# Altium schematic sheet EdgeMax_MCU.SchDoc
size A3; SheetNumber: 1; SheetTotal: 3
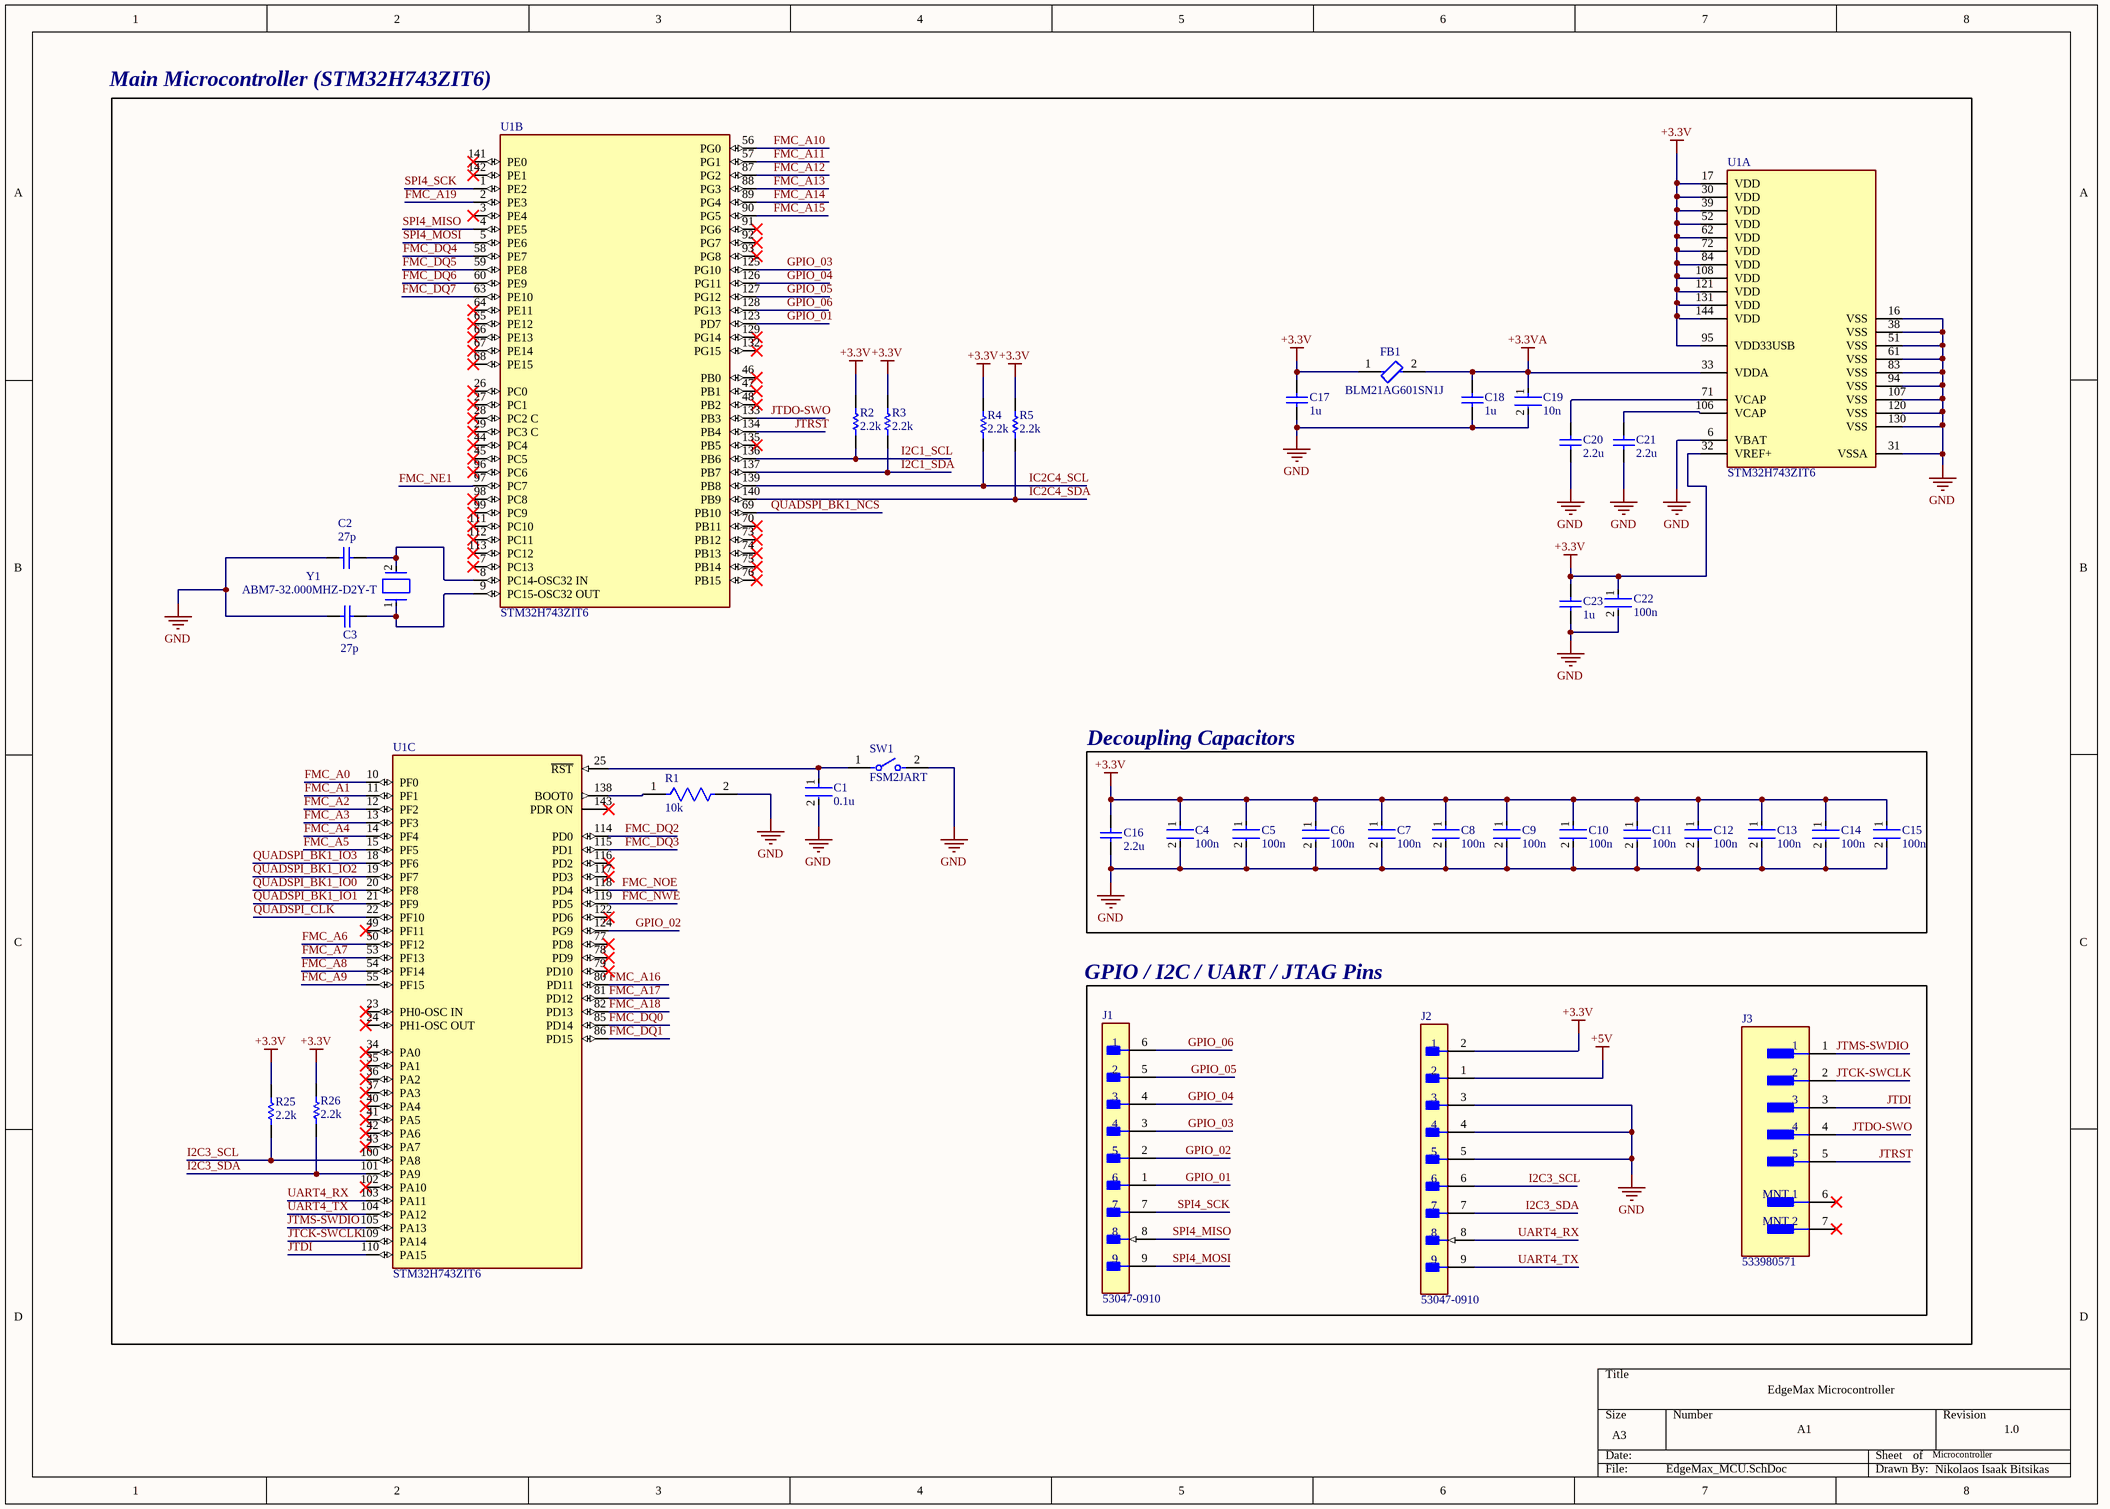
[diagram p0: EdgeMax_MCU.SchDoc]

## Parts
C1  0.1u  [FP-C1206C-EB-MFG]
C2  27p  [CAPC1005X55X25LL05T10]
C3  27p  [CAPC1005X55X25LL05T10]
C4  100n  [FP-CL10-IPC_A]
C5  100n  [FP-CL10-IPC_A]
C6  100n  [FP-CL10-IPC_A]
C7  100n  [FP-CL10-IPC_A]
C8  100n  [FP-CL10-IPC_A]
C9  100n  [FP-CL10-IPC_A]
C10  100n  [FP-CL10-IPC_A]
C11  100n  [FP-CL10-IPC_A]
C12  100n  [FP-CL10-IPC_A]
C13  100n  [FP-CL10-IPC_A]
C14  100n  [FP-CL10-IPC_A]
C15  100n  [FP-CL10-IPC_A]
C16  2.2u  [CAPC2013X135X50ML10T20]
C17  1u  [CAPC2013X145X50LL20T25]
C18  1u  [CAPC2013X145X50LL20T25]
C19  10n  [FP-CC0402-MFG]
C20  2.2u  [CAPC2013X135X50ML10T20]
C21  2.2u  [CAPC2013X135X50ML10T20]
C22  100n  [FP-CL10-IPC_A]
C23  1u  [CAPC2013X145X50LL20T25]
FB1  BLM21AG601SN1J  [FP-BLM21-0_2-t0_85-e0_5-IPC_A]
J1  53047-0910  [FP-53047-0910-MFG]
J2  53047-0910  [FP-53047-0910-MFG]
J3  533980571  [FP-533980571-MFG]
R1  10k  [FP-AC0603-MFG]
R2  2.2k  [RESC1005X40X25LL05T05]
R3  2.2k  [RESC1005X40X25LL05T05]
R4  2.2k  [RESC1005X40X25LL05T05]
R5  2.2k  [RESC1005X40X25LL05T05]
R25  2.2k  [RESC1005X40X25LL05T05]
R26  2.2k  [RESC1005X40X25LL05T05]
SW1  FSM2JART  [FP-FSM2JART-MFG]
U1  STM32H743ZIT6  [FP-LQFP144-1A-MFG]  (parts A,B,C of 3)
Y1  ABM7-32.000MHZ-D2Y-T  [FP-ABM7-MFG]

## Blocks framed on the sheet
Main Microcontroller (STM32H743ZIT6): C1-C3 C17-C23 FB1 R1-R5 R25 R26 SW1 U1 Y1
Decoupling Capacitors: C4-C16
GPIO / I2C / UART / JTAG Pins: J1-J3

## Nets
+3.3V: C4.1 C5.1 C6.1 C7.1 C8.1 C9.1 C10.1 C11.1 C12.1 C13.1 C14.1 C15.1 C16.2 C17.2 C22.1 C23.2 FB1.1 J2.2 R2.2 R3.2 R4.2 R5.2 R25.2 R26.2 U1.17(VDD) U1.30(VDD) U1.32(VREF+) U1.39(VDD) U1.52(VDD) U1.62(VDD) U1.72(VDD) U1.84(VDD) U1.95(VDD33USB) U1.108(VDD) U1.121(VDD) U1.131(VDD) U1.144(VDD)
+3.3VA: C18.2 C19.1 FB1.2 U1.33(VDDA)
+5V: J2.1
GND: C1.2 C2.2 C3.1 C4.2 C5.2 C6.2 C7.2 C8.2 C9.2 C10.2 C11.2 C12.2 C13.2 C14.2 C15.2 C16.1 C17.1 C18.1 C19.2 C20.1 C21.1 C22.2 C23.1 J2.3 J2.4 J2.5 R1.2 SW1.2 U1.6(VBAT) U1.16(VSS) U1.31(VSSA) U1.38(VSS) U1.51(VSS) U1.61(VSS) U1.83(VSS) U1.94(VSS) U1.107(VSS) U1.120(VSS) U1.130(VSS)
FMC_A0: U1.10(PF0)
FMC_A1: U1.11(PF1)
FMC_A2: U1.12(PF2)
FMC_A3: U1.13(PF3)
FMC_A4: U1.14(PF4)
FMC_A5: U1.15(PF5)
FMC_A6: U1.50(PF12)
FMC_A7: U1.53(PF13)
FMC_A8: U1.54(PF14)
FMC_A9: U1.55(PF15)
FMC_A10: U1.56(PG0)
FMC_A11: U1.57(PG1)
FMC_A12: U1.87(PG2)
FMC_A13: U1.88(PG3)
FMC_A14: U1.89(PG4)
FMC_A15: U1.90(PG5)
FMC_A16: U1.80(PD11)
FMC_A17: U1.81(PD12)
FMC_A18: U1.82(PD13)
FMC_A19: U1.2(PE3)
FMC_DQ0: U1.85(PD14)
FMC_DQ1: U1.86(PD15)
FMC_DQ2: U1.114(PD0)
FMC_DQ3: U1.115(PD1)
FMC_DQ4: U1.58(PE7)
FMC_DQ5: U1.59(PE8)
FMC_DQ6: U1.60(PE9)
FMC_DQ7: U1.63(PE10)
FMC_NOE: U1.118(PD4)
FMC_NWE: U1.119(PD5)
FMC_ΝΕ1: U1.97(PC7)
GPIO_01: J1.1 U1.123(PD7)
GPIO_02: J1.2 U1.124(PG9)
GPIO_03: J1.3 U1.125(PG10)
GPIO_04: J1.4 U1.126(PG11)
GPIO_05: J1.5 U1.127(PG12)
GPIO_06: J1.6 U1.128(PG13)
I2C1_SCL: R2.1 U1.136(PB6)
I2C1_SDA: R3.1 U1.137(PB7)
I2C3_SCL: J2.6 R25.1 U1.100(PA8)
I2C3_SDA: J2.7 R26.1 U1.101(PA9)
IC2C4_SCL: R4.1 U1.139(PB8)
IC2C4_SDA: R5.1 U1.140(PB9)
JTCK-SWCLK: J3.2 U1.109(PA14)
JTDI: J3.3 U1.110(PA15)
JTDO-SWO: J3.4 U1.133(PB3)
JTMS-SWDIO: J3.1 U1.105(PA13)
JTRST: J3.5 U1.134(PB4)
QUADSPI_BK1_IO0: U1.20(PF8)
QUADSPI_BK1_IO1: U1.21(PF9)
QUADSPI_BK1_IO2: U1.19(PF7)
QUADSPI_BK1_IO3: U1.18(PF6)
QUADSPI_BK1_NCS: U1.69(PB10)
QUADSPI_CLK: U1.22(PF10)
SPI4_MISO: J1.8 U1.4(PE5)
SPI4_MOSI: J1.9 U1.5(PE6)
SPI4_SCK: J1.7 U1.1(PE2)
UART4_RX: J2.8 U1.103(PA11)
UART4_TX: J2.9 U1.104(PA12)
NetC1_1: C1.1 SW1.1 U1.25(~{RST})
NetC2_1: C2.1 U1.8(PC14-OSC32_IN) Y1.2
NetC3_2: C3.2 U1.9(PC15-OSC32_OUT) Y1.1
NetC20_2: C20.2 U1.71(VCAP)
NetC21_2: C21.2 U1.106(VCAP)
NetR1_1: R1.1 U1.138(BOOT0)

Not connected (* = marked no-connect by the designer): J3 6(MNT_1)* 7(MNT_2)*; U1 3(PE4)* 7(PC13)* 23(PH0-OSC_IN)* 24(PH1-OSC_OUT)* 26(PC0)* 27(PC1)* 28(PC2_C)* 29(PC3_C)* 34(PA0)* 35(PA1)* 36(PA2)* 37(PA3)* 40(PA4)* 41(PA5)* 42(PA6)* 43(PA7)* 44(PC4)* 45(PC5)* 46(PB0)* 47(PB1)* 48(PB2)* 49(PF11)* 64(PE11)* 65(PE12)* 66(PE13)* 67(PE14)* 68(PE15)* 70(PB11)* 73(PB12)* 74(PB13)* 75(PB14)* 76(PB15)* 77(PD8)* 78(PD9)* 79(PD10)* 91(PG6)* 92(PG7)* 93(PG8)* 96(PC6)* 98(PC8)* 99(PC9)* 102(PA10)* 111(PC10)* 112(PC11)* 113(PC12)* 116(PD2)* 117(PD3)* 122(PD6)* 129(PG14)* 132(PG15)* 135(PB5)* 141(PE0)* 142(PE1)* 143(PDR_ON)*

## Notes on the sheet
- EdgeMax Microcontroller
- A1
- Microcontroller
- 1.0
- Nikolaos Isaak Bitsikas

## Library data of the parts
C1 = CMP-1037-04092-2: C1206 68,000 pF X7R 10.00% 50 V; Manufacturer: KEMET; Manufacturer Part Number: C1206C683K5RAC; Temperature Coefficient: 15%; Automotive Grade: Grade 0; Material: Ceramic; Tolerance: 0.1; Voltage Rating: 50 V; Category: Cap; Temperature Range High: +150°C; Device Class L3: Ceramic Capacitors; Ipc Land Pattern Name: CAPC320160X78; ComponentLink2Description: Datasheet; Value: 68,000 pF; Octopart: https://octopart.com/c1206c683k5rac-kemet-1491650; Automotive: Yes; Capacitance: 68,000 pF; Package: C1206C-EB; Lead Free: Yes; RoHS: TRUE; Mouser Description: Multilayer Ceramic Capacitors MLCC - SMD/SMT 50volts 0.068uF 10% X7R; Temperature Range Low: -55°C; Height: 0.88mm; Temperature: -55°C to +150°C; Device Class L2: Capacitors; ComponentLink2URL: https://content.kemet.com/datasheets/KEM_C1007_X8R_ULTRA_150C_SMD.pdf; Device Class L1: Passive Components; Temperature Characteristic: X7R
C2 C3 = CMP-2008-03917-1: Part Number: GRM1555C1H270JA01D; Manufacturer: Murata
C4-C15 C22 = CMP-13271-000587-1: Cap Ceramic 100nF 50V X7R ±10% Pad SMD 0603 +125°C T/R; Case/Package: 0603; Depth: 0.8mm; Max Operating Temperature: 125°C; Lead Free: Lead Free; Material: Ceramic; Voltage Rating: 50V; Min Operating Temperature: -55°C; Voltage Rating (DC): 50V; Dielectric: X7R; Height: 0.8mm; Capacitance: 100nF; Thickness: 0.035inch; Radiation Hardening: No; Voltage: 50V; Packaging: Tape and Reel; Length: 1.6mm; Tolerance: 10%; Width: 0.031inch; Mount: Surface Mount; Package Quantity: 10000
C16 C20 C21 = CMP-2007-03455-1: Manufacturer: Murata; Part Number: GRM21BR71C225KA12L
C17 C18 C23 = CMP-1036-04746-2: Manufacturer: Kemet; Part Number: C0805C105K4PACTU
C19 = CMP-03422-000420-1: CC0402 10 nF X7R 10.00% 16 V; Manufacturer: YAGEO; Manufacturer Part Number: CC0402KPX7R7BB103; Capacitance: 10 nF; Value: 10 nF; Tolerance: 0.1; Voltage Rating: 16 V; Automotive Grade: NA; Temperature Coefficient: 30ppm/°C; Material: Ceramic; Automotive: No; Device Class L1: Passive Components; Temperature Range Low: -55°C; Ipc Land Pattern Name: CAPC10050X50; Temperature Characteristic: X7R; Lead Free: Yes; Footprint Url: http://www.yageo.com/exep/pages/download/literatures/UPY-C_GEN_24.pdf; Octopart: https://octopart.com/cc0402kpx7r7bb103-yageo-12885102; RoHS: TRUE; Height: 0.55mm; Device Class L3: Ceramic Capacitors; Mouser Description: Multilayer Ceramic Capacitors MLCC - SMD/SMT 10nF 16V X7R 10%; Package: CC0402; ComponentLink2Description: Datasheet; Category: Cap; ComponentLink2URL: http://www.yageo.com/documents/recent/UPY-GP_NP0_16V-to-50V_16.pdf; Temperature: -55°C to +125°C; Temperature Range High: +125°C; Device Class L2: Capacitors
FB1 = CMP-0686-00643-3: Chip Ferrite Bead, 0805, 600Ω @ 100MHz, 0.2Ω, 25%, 700mA; Current Rating: 600mA; Impedance: 600R; DC Resistance (DCR): 210mR; Max Current Rating: 200mA; Number of Circuits: 1; RoHS Compliant: Yes; Test Frequency: 100MHz; Number of Pins: 2; Case Code (Metric): 2012; Depth: 0.85mm; Height: 1.25mm; Case Code (Imperial): 0805; Case/Package: 0805; DC Current: 200mA; Max Operating Temperature: 125°C; Core Material: Ferrite; Length: 2.2mm; Tolerance: 25%; Packaging: Tape and Reel; Min Operating Temperature: -55°C; Radiation Hardening: No; Termination: Flat
J1 J2 = CMP-04776-000285-1: CONN HEADER VERT 9POS 1.25MM; Gender: Male; Current Rating: 1A; Number of Poles: 9; Body Plating: Tin; Voltage Rating: 125V; Contact Resistance: 20mR; Glow Wire Compliant: Non-compliant; Insulation Resistance: 100MR; Color: Natural; Min Operating Temperature: -40°C; Mount: Through Hole; Lead Free: Lead Free; Orientation: Vertical; Flammability Rating: UL94 V-0; Max Operating Temperature: 85°C; Series: PicoBlade; Number of Rows: 1; Number of Circuits: 9; Housing Material: Polyamide; Housing Color: Natural; Contact Plating: Tin; Termination: Solder; Packaging: Tray; Lead Pitch: 1.25mm; Working Voltage: 125V; Contact Material: Bronze; Radiation Hardening: No; Number of Positions: 9; RoHS Compliant: Yes; Package Quantity: 2000; Number of Contacts: 9; Voltage Rating (DC): 125V; Voltage Rating (AC): 125V; Pitch: 1.25mm
J3 = CMP-2000-05250-2: CONN HEADER SMD 5POS 1.25MM; Manufacturer: Molex; Number Of Contacts: 5; Conn Orientation: Vertical; Current Rating: 1A; Voltage Rating: 125V; Conn Gender: Male; Standoff Height: 0.05mm; Package: CONN_HDR5; Contact Material: Tin,Nickel; ComponentLink2Description: Datasheet; Footprint Url: https://www.molex.com/pdm_docs/sd/533980571_sd.pdf; Device Class L3: unset; Manufacturer Part Number: 533980571; Digikey Description: CONN HEADER SMD 5POS 1.25MM; Automotive: No; Lead Free: Yes; Device Class L1: Connectors; Temperature Range High: +105°C; Number Of Rows: 1; Mouser Description: Wire-To-Board Connector, Vertical, PicoBlade 53398 Series, Surface Mount, Header, 5, 1.25 mm; Octopart: https://octopart.com/53398-0571-molex-655292; ComponentLink2URL: https://www.molex.com/webdocs/datasheets/pdf/en-us/0533980571_PCB_HEADERS.pdf; Category: Conn; Device Class L2: Headers and Wire Housings; Pitch: 1.25mm; Ipc Land Pattern Name: HDRV5W64P254_1X5_2032X64X457; RoHS: TRUE; Temperature: -40°C to +105°C; Height: 4.9mm; Temperature Range Low: -40°C
R1 = CMP-2000-04818-3: RES 10KΩ 1.00% 0.1W 0603; Power Rating: 100mW; Tolerance: 1%; Resistance: 10kR; Voltage Rating: 50V; Temperature Coefficient: 100ppm/°C; Ratings: AEC-Q200; Case Code (Metric): 1608; Max Power Dissipation: 100mW; Height: 0.45mm; Package Quantity: 1; Max Operating Temperature: 155°C; Resistor Type: Thick Film; Depth: 0.8mm; RoHS Compliant: Yes; Min Operating Temperature: -55°C; Packaging: Tape and Reel; Number of Terminations: 2; Length: 1.6mm; Features: Moisture Resistant; Military Standard: Not; Case Code (Imperial): 0603; Size Code: 0603; Termination: SMD/SMT; Case/Package: 0603; Mount: Surface Mount; Width: 0.8mm; Lead Free: Lead Free; Series: AC; Construction: Rectangular
R2-R5 R25 R26 = CMP-2002-01132-2: Precision Thick Film Chip Resistor, 2.2 kOhm, 100 mW, 1%, -55 to 155 degC, 2-Pin SMD (0402), RoHS, Tape and Reel; Manufacturer: Panasonic; Resistance: 2.2kO; Temp Coefficient: ±100ppm/°C; Rated Power: 0.1W; Datasheet URL: https://datasheet.ciiva.com/11821/0900766b80f80784-11821273.pdf; Tolerance (%): ±1%; Mounting Technology: SurfaceMount; Package Description: 2-Pin Surface Mount Device, Body 1 x 0.5 mm; Manufacturer URL: http://www.panasonic.com/; Datasheet Version: 03/2011; Package Reference: 0402; Size Code: 0402
SW1 = CMP-03407-000009-1: SWITCH TACTILE SPST-NO 0.05A 12V; Actuator Length: 0.7mm; Switch Function: Off-Mom; Throw Configuration: SPST; Electrical Life: 100000Cycles; Illumination Type: Non-Illuminated; Contact Resistance: 100mR; Operating Force: 260gf; Actuator Type: Standard; Actuator Material: Resin; Contact Current Rating: 50mA; Type: Switch; Contact Plating: Silver; ELV: Compliant; Lead Free: Lead Free; Max Voltage Rating (DC): 12V; Min Operating Temperature: -35°C; Mount: Through Hole; Series: FSMJRT; Max Operating Temperature: 105°C; RoHS Compliant: Yes; Termination: Solder; REACH SVHC: No SVHC; Contact Material: Copper Alloy; Orientation: Straight; Current Rating: 50mA; Package Quantity: 1000; Voltage Rating (DC): 12V; Packaging: Tape and Reel
U1 = CMP-12105-000003-1: IC MCU 32BIT 2MB FLASH 144LQFP; Manufacturer: STMicroelectronics; Number Of I2C Channels: 4; Number Of A/D Converters: 2; Standoff Height: 0.05mm; Interface: I2C,SPI,UART,USART,EBI/EMI,CAN,USB,LIN,IrDA,Other; Max Supply Voltage: 3.6V; Number Of Adc Channels: 36; Ram Size: 1MBytes; Number Of Cores: 1; Frequency: 400MHz; Data Bus Width: 32bits; Core Architecture: ARM Cortex-M7; Memory Size: 2MBytes; Number Of Timers/Counters: 22; Min Supply Voltage: 1.62V; Number Of Spi Channels: 6; Max Junction Temp: +125°C; Number Of I/Os: 114; Digikey Description: IC MCU 32BIT 2MB FLASH 144LQFP; Device Class L2: Embedded Processors and Controllers; Number Of Usb Channels: 2; ComponentLink2Description: Datasheet; Ipc Land Pattern Name: QFP50P2200X2200X160-144; Category: IC; Lead Free: Yes; Temperature Range High: +85°C; Mouser Description: MCU 32-Bit STM32 ARM Cortex M7 RISC 2MB Flash 1.8V/2.5V/3.3V 144-Pin LQFP Tray; RoHS: TRUE; Ambient Temperature Range Low: -40°C; Temperature Range Low: -40°C; ComponentLink2URL: https://www.st.com/resource/en/datasheet/stm32h743zi.pdf; Ambient Temperature Range High: +85°C; Octopart: https://octopart.com/stm32h743zit6-stmicroelectronics-76372529; Number Of Pwm Channels: 2; Height: 1.6mm; Manufacturer Part Number: STM32H743ZIT6; Device Class L3: Microcontrollers; Device Class L1: Integrated Circuits (ICs); Automotive: No; Memory Type: FLASH; Number Of Uart Channels: 4; Package: LQFP144-1A; Temperature: -40°C to +85°C
Y1 = CMP-27762-013665-1: Crystal 32MHz ±20ppm 18pF SMD-2 6mm x 3.5mm; ESR (Equivalent Series Resistance): 50R; Frequency Stability: 30ppm; Operating Frequency: 32 MHz; Termination: SMD/SMT; Packaging: Tape and Reel; Min Operating Temperature: -40°C; Lead Free: Lead Free; Series: ABM7; Load Capacitance: 18pF; Tolerance: 20ppm; Depth: 3.5mm; Frequency Tolerance: 20ppm; Number of Pins: 2; Radiation Hardening: No; Width: 3.3mm; Mount: Surface Mount; Height: 0.055inch; Max Operating Temperature: 85°C; Series Resistance: 50R; Package Quantity: 1000; Resistor Type: Ceramic; Length: 6mm; Frequency: 32MHz; Case/Package: CSMD